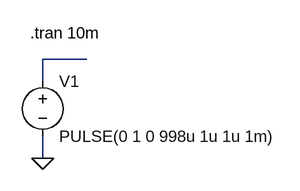
[diagram p0: schematic Sawtooth.asc]
Sawtooth.asc, the LTspice schematic file:
Version 4
SHEET 1 880 680
WIRE 0 192 0 160
WIRE 0 304 0 272
WIRE 64 160 0 160
FLAG 0 304 0
SYMBOL voltage 0 176 R0
WINDOW 123 0 0 Left 0
WINDOW 39 0 0 Left 0
SYMATTR InstName V1
SYMATTR Value PULSE(0 1 0 998u 1u 1u 1m)
TEXT -18 122 Left 0 !.tran 10m

The netlist it stands for:
* Sawtooth.asc
V1 N001 0 PULSE(0 1 0 998u 1u 1u 1m)
.tran 10m
.backanno
.end